# Altium project Inverter.PrjPCB
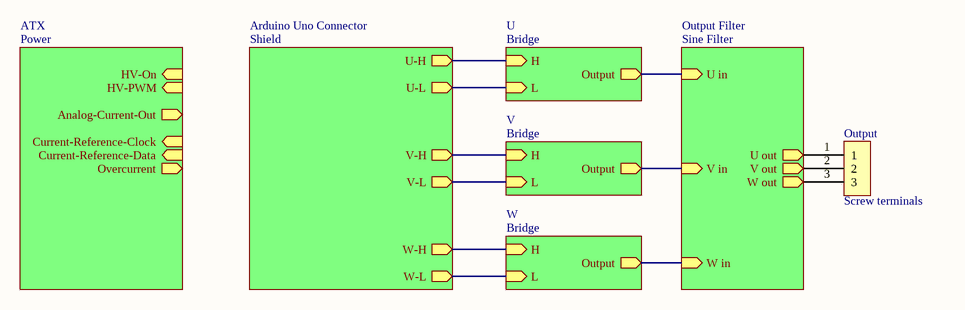
[diagram p0: Top.SchDoc]
6 sheets, 65 parts. Net scope: hierarchical (ports join the sheet entries above them; power ports are global).
Board file: Inverter.PcbDoc
Sheets:
  Top.SchDoc
    U = Bridge.SchDoc
    V = Bridge.SchDoc
    W = Bridge.SchDoc
    Output Filter = Sine Filter.SchDoc
    Arduino Uno Connector = Shield.SchDoc
    ATX = Power.SchDoc
      ISense = Current Measurement.SchDoc

## Sheet Top.SchDoc
size A4

### Parts
Output  Screw terminals  [DG301-5.0-03]

### Sub-sheets
Arduino Uno Connector = Shield: V-H (out), U-H (out), U-L (out), V-L (out), W-H (out), W-L (out)
ATX = Power: HV-On (in), HV-PWM (in), Current-Reference-Clock (in), Current-Reference-Data (in), Overcurrent (out), Analog-Current-Out (out)
Output Filter = Sine Filter: W out (out), V out (out), U out (out), W in (in), V in (in), U in (in)
U = Bridge: H (in), L (in), Output (out)
V = Bridge: H (in), L (in), Output (out)
W = Bridge: H (in), L (in), Output (out)

### Nets
H_IN_U: sheet U/H, sheet Arduino Uno Connector/U-H
H_IN_V: sheet V/H, sheet Arduino Uno Connector/V-H
H_IN_W: sheet W/H, sheet Arduino Uno Connector/W-H
L_IN_U: sheet U/L, sheet Arduino Uno Connector/U-L
L_IN_V: sheet V/L, sheet Arduino Uno Connector/V-L
L_IN_W: sheet W/L, sheet Arduino Uno Connector/W-L
Output: sheet U/Output, sheet Output Filter/U in
Output: sheet V/Output, sheet Output Filter/V in  [a separate net that carries the same name]
Output: sheet W/Output, sheet Output Filter/W in  [a separate net that carries the same name]
NetF-C1_1: Output.1 ; sheet Output Filter/U out
NetF-C1_2: Output.2 ; sheet Output Filter/V out
NetF-C2_2: Output.3 ; sheet Output Filter/W out

### Library data of the parts
Output = Header 1x3

## Sheet Bridge.SchDoc
size A4
Used 3 times, as channels U, V, W. Parts and nets are listed once, with the designators drawn on the sheet.
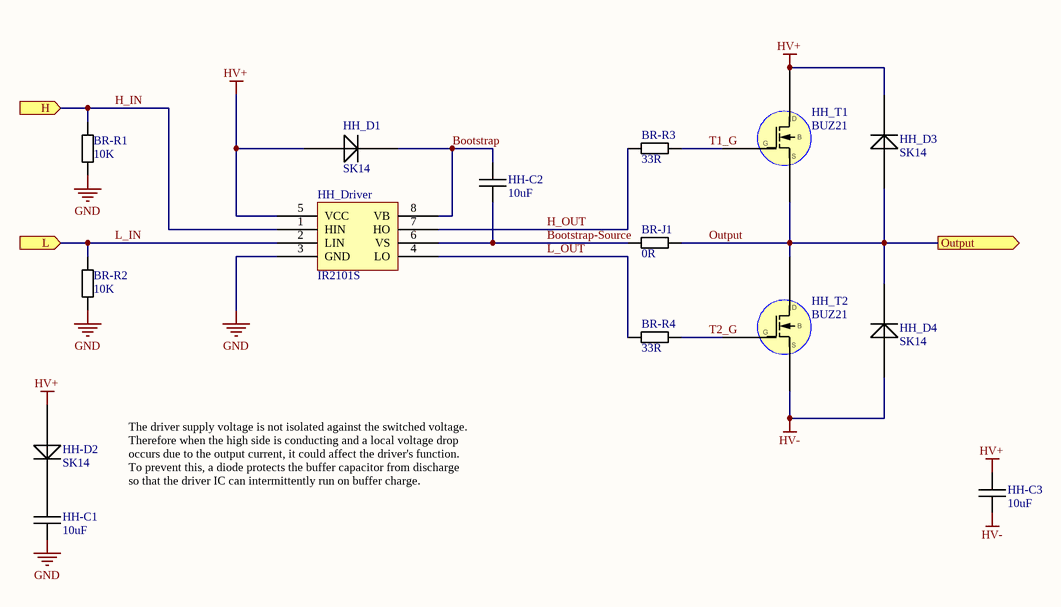
[diagram p1: Bridge.SchDoc]

### Parts
BR-J1  0R  [R 0805 / 2012 wide]
BR-R1  10K  [R 0805 / 2012]
BR-R2  10K  [R 0805 / 2012]
BR-R3  33R  [R 0805 / 2012]
BR-R4  33R  [R 0805 / 2012]
HH-C1  10uF  [C 0805 / 2012]
HH-C2  10uF  [C 0805 / 2012]
HH-C3  10uF  [Header 1x2+1 1.0mm]
HH-D2  SK14  [SC-90]
HH_D1  SK14  [SC-90]
HH_D3  SK14  [SC-90]
HH_D4  SK14  [SC-90]
HH_Driver  IR2101S  [SOIC-8]
HH_T1  BUZ21  [TO-220 AB]
HH_T2  BUZ21  [TO-220 AB]

### Ports
H (in), L (in), Output (out)

### Nets
GND: BR-R1.1 BR-R2.1 HH-C1.2 HH_Driver.3(GND)
HV+: HH-C3.1 HH-D2.2 HH_D1.2 HH_D3.1 HH_Driver.5(VCC) HH_T1.2
HV-: HH-C3.2 HH_D4.2 HH_T2.3
Bootstrap: HH-C2.1 HH_D1.1 HH_Driver.8(VB)
Bootstrap-Source: BR-J1.1 HH-C2.2 HH_Driver.6(VS)
H_IN: BR-R1.2 HH_Driver.1(HIN) ; port H
H_OUT: BR-R3.1 HH_Driver.7(HO)
L_IN: BR-R2.2 HH_Driver.2(LIN) ; port L
L_OUT: BR-R4.1 HH_Driver.4(LO)
Output: BR-J1.2 HH_D3.2 HH_D4.1 HH_T1.3 HH_T2.2 ; port Output
T1_G: BR-R3.2 HH_T1.1
T2_G: BR-R4.2 HH_T2.1
NetHH-C1_1: HH-C1.1 HH-D2.1

### Channels
U: designators end in _U; ports H=H_IN_U L=L_IN_U Output=Output
V: designators end in _V; ports H=H_IN_V L=L_IN_V Output=Output
W: designators end in _W; ports H=H_IN_W L=L_IN_W Output=Output

### Notes on the sheet
- The driver supply voltage is not isolated against the switched voltage.
  Therefore when the high side is conducting and a local voltage drop
  occurs due to the output current, it could affect the driver's function.
  To prevent this, a diode protects the buffer capacitor from discharge
  so that the driver IC can intermittently run on buffer charge.

### Library data of the parts
BR-J1 BR-R1-BR-R4 = Resistor
HH-C1-HH-C3 = Capacitor
HH-D2 HH_D1 HH_D3 HH_D4 = Diode
HH_Driver = IR21xx: High and Low Side Driver; Website: http://www.irf.com/part/High-and-Low-Side-Driver-Noninverting-Inputs/_/A~IR2101
HH_T1 HH_T2 = FET N-Channel: Enhancement Type

## Sheet Sine Filter.SchDoc
size A4
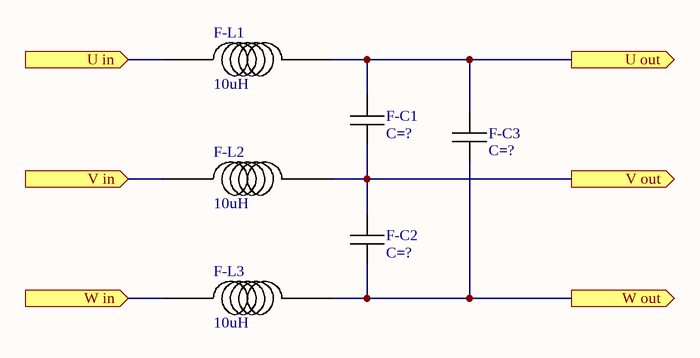
[diagram p2: Sine Filter.SchDoc]

### Parts
F-C1  C=?
F-C2  C=?
F-C3  C=?
F-L1  10uH  [Header 1x2+1 1.0mm]
F-L2  10uH  [Header 1x2+1 1.0mm]
F-L3  10uH  [Header 1x2+1 1.0mm]

### Ports
U in (in), U out (out), V in (in), V out (out), W in (in), W out (out)

### Nets
Output: F-L1.1 ; port U in
Output: F-L2.1 ; port V in  [a separate net that carries the same name]
Output: F-L3.1 ; port W in  [a separate net that carries the same name]
NetF-C1_1: F-C1.1 F-C3.1 F-L1.2 ; port U out
NetF-C1_2: F-C1.2 F-C2.1 F-L2.2 ; port V out
NetF-C2_2: F-C2.2 F-C3.2 F-L3.2 ; port W out

### Library data of the parts
F-C1-F-C3 = Capacitor
F-L1-F-L3 = Coil

## Sheet Shield.SchDoc
size A4
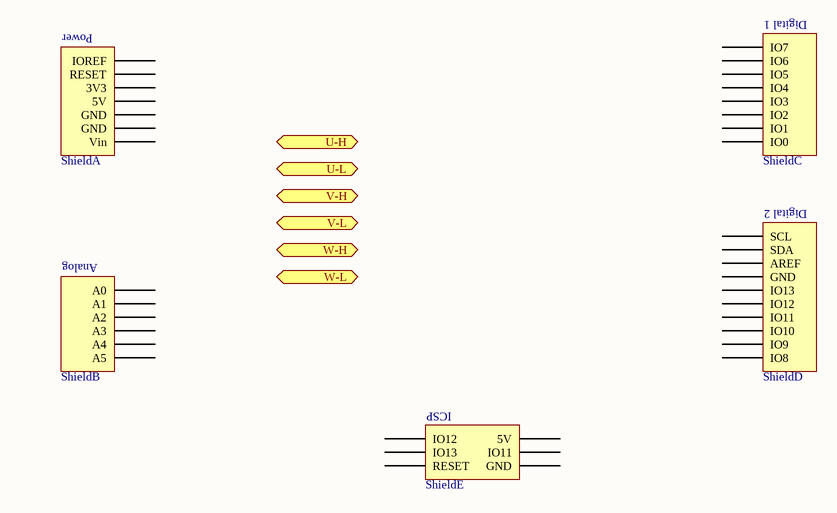
[diagram p3: Shield.SchDoc]

### Parts
Shield  Arduino Uno  [Arduino Uno Adapter]  (value not drawn)  (parts A,B,C,D,E of 5)

### Ports
U-H (out), U-L (out), V-H (out), V-L (out), W-H (out), W-L (out)

### Nets

Not connected (* = marked no-connect by the designer): Shield 0(IO0) 1(IO1) 2(IO2) 3(IO3) 3V3 4(IO4) 5(IO5) 5V 6(IO6) 7(IO7) 8(IO8) 9(IO9) 10(IO10) 11(IO11) 12(IO12) 13(IO13) A0 A1 A2 A3 A4 A5 AREF GND1(GND) GND2(GND) GND3(GND) ICSP1(IO12) ICSP2(5V) ICSP3(IO13) ICSP4(IO11) ICSP5(RESET) ICSP6(GND) IOREF RESET SCL SDA Vin

### Notes on the sheet
- (in symbol Arduino Uno, part A) Power
- (in symbol Arduino Uno, part B) Analog
- (in symbol Arduino Uno, part C) Digital 1
- (in symbol Arduino Uno, part D) Digital 2
- (in symbol Arduino Uno, part E) ICSP

## Sheet Power.SchDoc
size A4
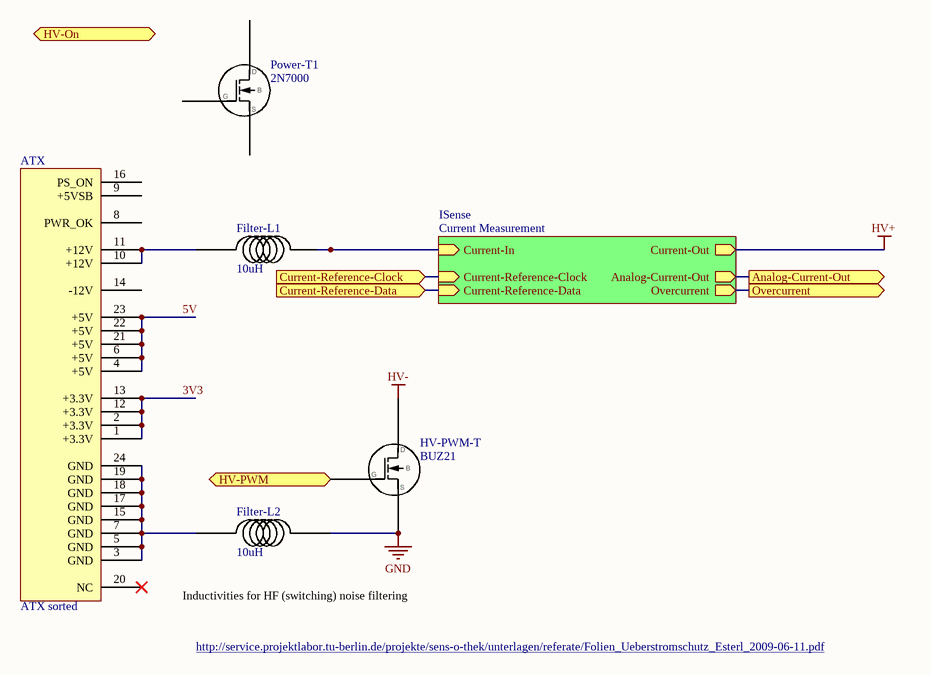
[diagram p4: Power.SchDoc]

### Parts
ATX  ATX sorted  [ATX]
Filter-L1  10uH  [Header 1x2+1 1.0mm]
Filter-L2  10uH  [Header 1x2+1 1.0mm]
HV-PWM-T  BUZ21
Power-T1  2N7000  [SOT-23-3]

### Sub-sheets
ISense = Current Measurement: Current-Out (out), Overcurrent (out), Current-In (in), Current-Reference-Clock (in), Current-Reference-Data (in), Analog-Current-Out (out)

### Ports
Analog-Current-Out (out), Current-Reference-Clock (in), Current-Reference-Data (in), HV-On (in), HV-PWM (in), Overcurrent (out)

### Nets
GND: Filter-L2.2 HV-PWM-T.S
HV-: HV-PWM-T.D
3V3: ATX.1(+3.3V) ATX.2(+3.3V) ATX.12(+3.3V) ATX.13(+3.3V)
5V: ATX.4(+5V) ATX.6(+5V) ATX.21(+5V) ATX.22(+5V) ATX.23(+5V)
NetATX_3: ATX.3(GND) ATX.5(GND) ATX.7(GND) ATX.15(GND) ATX.17(GND) ATX.18(GND) ATX.19(GND) ATX.24(GND) Filter-L2.1
NetATX_10: ATX.10(+12V) ATX.11(+12V) Filter-L1.1
NetFilter-L1_2: Filter-L1.2 ; sheet ISense/Current-In
NetHV-PWM-T_G: HV-PWM-T.G ; port HV-PWM
NetISense-OpAmp_1: port Analog-Current-Out, sheet ISense/Analog-Current-Out
NetISense-OpAmp_7: port Overcurrent, sheet ISense/Overcurrent
(unnamed): port Current-Reference-Clock, sheet ISense/Current-Reference-Clock
(unnamed): port Current-Reference-Data, sheet ISense/Current-Reference-Data

Not connected (* = marked no-connect by the designer): ATX 8(PWR_OK) 9(+5VSB) 14(-12V) 16(PS_ON) 20(NC)*; Power-T1 1 2 3

### Notes on the sheet
- Inductivities for HF (switching) noise filtering
- http://service.projektlabor.tu-berlin.de/projekte/sens-o-thek/unterlagen/referate/Folien_Ueberstromschutz_Esterl_2009-06-11.pdf

### Library data of the parts
Filter-L1 Filter-L2 = Coil
HV-PWM-T = FET N-Channel: Enhancement Type
Power-T1 = 2N7000: N-FET

## Sheet Current Measurement.SchDoc
size A4
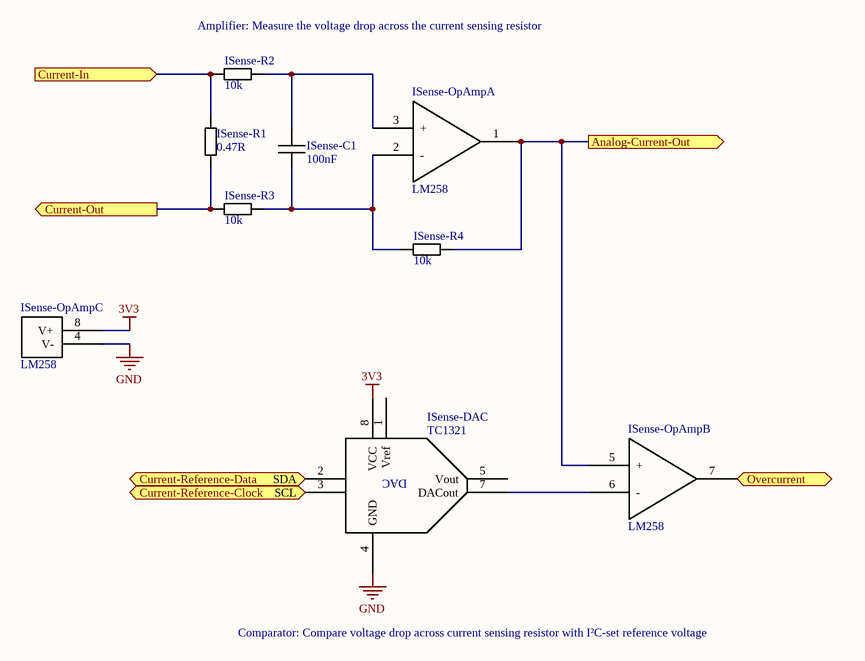
[diagram p5: Current Measurement.SchDoc]

### Parts
ISense-C1  100nF  [C 0805 / 2012]
ISense-DAC  TC1321  [SOIC-8]
ISense-OpAmp  LM258  [SOIC-8]  (parts A,B,C of 3)
ISense-R1  0.47R  [R 0805 / 2012]
ISense-R2  10k  [R 0805 / 2012]
ISense-R3  10k  [R 0805 / 2012]
ISense-R4  10k  [R 0805 / 2012]

### Ports
Analog-Current-Out (out), Current-In (in), Current-Out (out), Current-Reference-Clock (in), Current-Reference-Data (in), Overcurrent (out)

### Nets
3V3: ISense-DAC.8(VCC) ISense-OpAmp.8(V+)
GND: ISense-DAC.4(GND) ISense-OpAmp.4(V-)
HV+: ISense-R1.1 ISense-R3.1 ; port Current-Out
NetFilter-L1_2: ISense-R1.2 ISense-R2.1 ; port Current-In
NetISense-C1_1: ISense-C1.1 ISense-OpAmp.3(+) ISense-R2.2
NetISense-C1_2: ISense-C1.2 ISense-OpAmp.2(-) ISense-R3.2 ISense-R4.1
NetISense-DAC_7: ISense-DAC.7(DACout) ISense-OpAmp.6(-)
NetISense-OpAmp_1: ISense-OpAmp.1(OUT) ISense-OpAmp.5(+) ISense-R4.2 ; port Analog-Current-Out
NetISense-OpAmp_7: ISense-OpAmp.7(OUT) ; port Overcurrent

Not connected (* = marked no-connect by the designer): ISense-DAC 1(Vref) 2(SDA) 3(SCL) 5(Vout)

### Notes on the sheet
- (near ISense-R2) Amplifier: Measure the voltage drop across the current sensing resistor
- Comparator: Compare voltage drop across current sensing resistor with I²C-set reference voltage
- (in symbol TC1321) DAC

### Library data of the parts
ISense-C1 = Capacitor
ISense-DAC = TC1321: DAC 10-Bit Two-Wire
ISense-OpAmp = LM258: Dual OpAmp
ISense-R1-ISense-R4 = Resistor

## Nets that join several sheets
GND: U (BR-R1_U.1 BR-R2_U.1 HH-C1_U.2 HH_Driver_U.3), V (BR-R1_V.1 BR-R2_V.1 HH-C1_V.2 HH_Driver_V.3), W (BR-R1_W.1 BR-R2_W.1 HH-C1_W.2 HH_Driver_W.3), Power (Filter-L2.2 HV-PWM-T.S), Current Measurement (ISense-DAC.4 ISense-OpAmp.4)
HV+: U (6 pins), V (6 pins), W (6 pins), Current Measurement (ISense-R1.1 ISense-R3.1)
HV-: U (HH-C3_U.2 HH_D4_U.2 HH_T2_U.3), V (HH-C3_V.2 HH_D4_V.2 HH_T2_V.3), W (HH-C3_W.2 HH_D4_W.2 HH_T2_W.3), Power (HV-PWM-T.D)
NetF-C1_1: Top (Output.1), Sine Filter (F-C1.1 F-C3.1 F-L1.2)
NetF-C1_2: Top (Output.2), Sine Filter (F-C1.2 F-C2.1 F-L2.2)
NetF-C2_2: Top (Output.3), Sine Filter (F-C2.2 F-C3.2 F-L3.2)
NetFilter-L1_2: Power (Filter-L1.2), Current Measurement (ISense-R1.2 ISense-R2.1)
Output: U (5 pins), Sine Filter (F-L1.1)
Output: V (5 pins), Sine Filter (F-L2.1)
Output: W (5 pins), Sine Filter (F-L3.1)